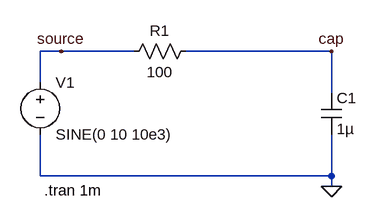
[diagram p0: schematic 01_RC_circuit.asc]
01_RC_circuit.asc, the LTspice schematic file:
Version 4
SHEET 1 880 680
WIRE 80 80 48 80
WIRE 192 80 80 80
WIRE 496 80 272 80
WIRE 48 128 48 80
WIRE 496 144 496 80
WIRE 48 272 48 208
WIRE 496 272 496 208
WIRE 496 272 48 272
WIRE 496 288 496 272
FLAG 496 80 cap
FLAG 80 80 source
FLAG 496 288 0
SYMBOL voltage 48 112 R0
WINDOW 123 0 0 Left 0
WINDOW 39 0 0 Left 0
SYMATTR InstName V1
SYMATTR Value SINE(0 10 10e3)
SYMBOL res 288 64 R90
WINDOW 0 0 56 VBottom 2
WINDOW 3 32 56 VTop 2
SYMATTR InstName R1
SYMATTR Value 100
SYMBOL cap 480 144 R0
SYMATTR InstName C1
SYMATTR Value 1µ
TEXT 54 294 Left 2 !.tran 1m

The netlist it stands for:
* 01_RC_circuit.asc
V1 source 0 SINE(0 10 10e3)
R1 cap source 100
C1 cap 0 1µ
.tran 1m
.backanno
.end

* Results of the author's LTspice run, read from the files saved beside the schematic
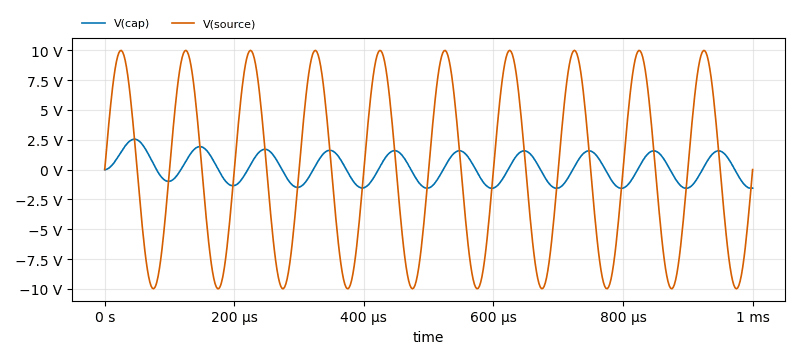
[diagram p1: Transient Analysis of 01_RC_circuit.asc, plotted from the saved traces]
* Transient Analysis, 1 run:
*   V(cap): min -1.569 V, max 2.542 V, average 155.1 mV, rms 1.163 V, last -1.552 V
*   V(source): min -9.99 V, max 9.99 V, average 6.534 µV, rms 7.064 V, last 0 V